# Altium schematic sheet SDCard.SchDoc: SD Card
size A; DocumentNumber: 7; SheetNumber: 7; SheetTotal: 9
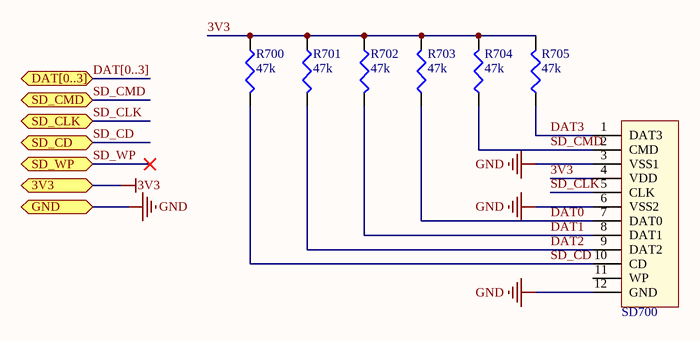
[diagram p0: SDCard.SchDoc]

## Parts
R700  value 47k  [SMD0603]  (hidden comment: Res)
R701  value 47k  [SMD0603]  (hidden comment: Res)
R702  value 47k  [SMD0603]  (hidden comment: Res)
R703  value 47k  [SMD0603]  (hidden comment: Res)
R704  value 47k  [SMD0603]  (hidden comment: Res)
R705  value 47k  [SMD0603]  (hidden comment: Res)
SD700  SD Card Slot  [SDCARD-AMP]  (value not drawn)

## Ports
3V3, DAT[0..3], GND, SD_CD, SD_CLK, SD_CMD, SD_WP

## Nets
3V3: R700.1 R701.1 R702.1 R703.2 R704.2 R705.2 SD700.4(VDD) ; port 3V3
GND: SD700.3(VSS1) SD700.6(VSS2) SD700.12(GND) ; port GND
DAT0: R703.1 SD700.7(DAT0)
DAT1: R702.2 SD700.8(DAT1)
DAT2: R701.2 SD700.9(DAT2)
DAT3: R705.1 SD700.1(DAT3)
SD_CD: R700.2 SD700.10(CD) ; port SD_CD
SD_CLK: SD700.5(CLK) ; port SD_CLK
SD_CMD: R704.1 SD700.2(CMD) ; port SD_CMD
SD_WP: port SD_WP

Not connected (* = marked no-connect by the designer): SD700 11(WP)

## Buses and harness runs
bus DAT[0..3] = port DAT[0..3]

## Library data of the parts
R700-R705 = Resistor
SD700 = SD Card Slot: SD Card Connector (Amphenol); pin to pad: 12>GND